# Altium schematic sheet LED_Sch1.SchDoc
size 635 x 342 mm
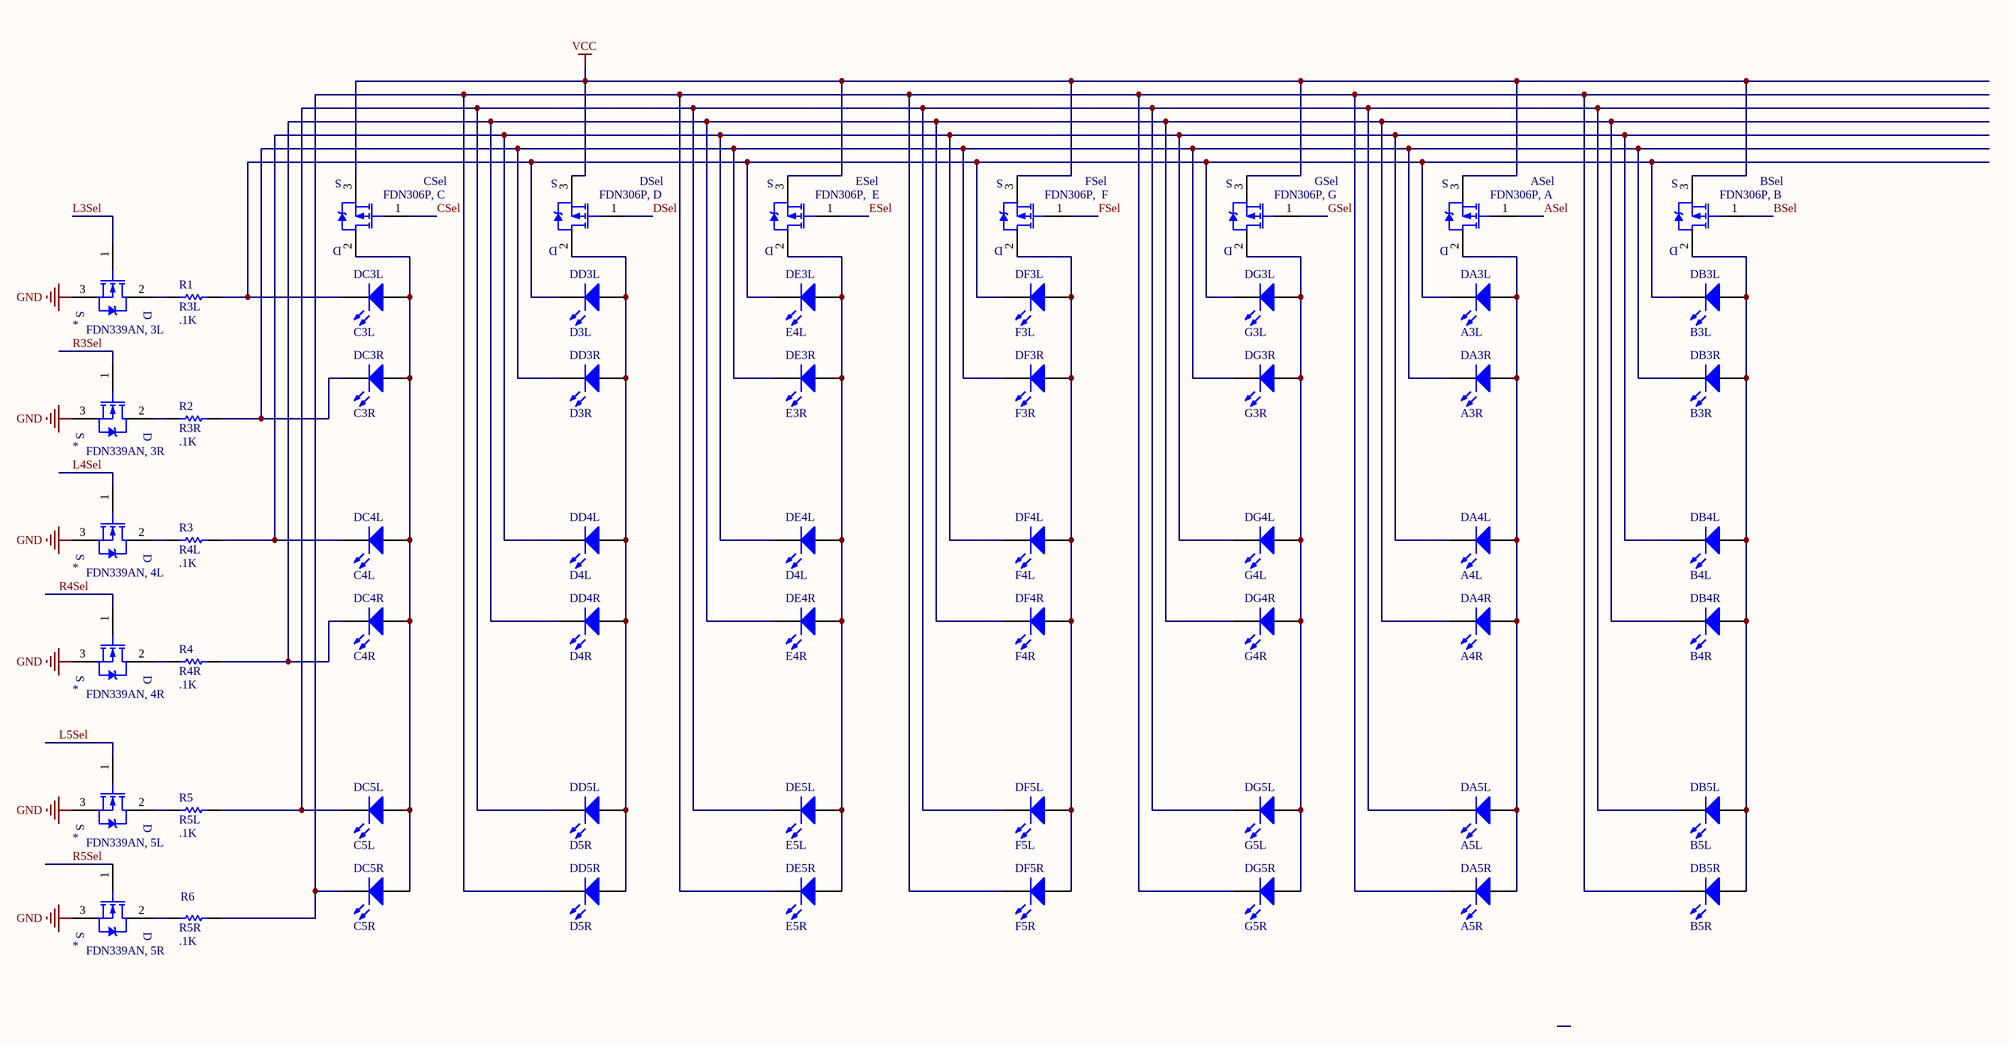
[diagram p0: LED_Sch1.SchDoc]

## Parts
(Parts that share a designator on the sheet are numbered #1, #2 ... from top to bottom, then left to right.)
*#1  FDN339AN, 3L  [SOT23-3M]
*#2  FDN339AN, 3R  [SOT23-3M]
*#3  FDN339AN, 4L  [SOT23-3M]
*#4  FDN339AN, 4R  [SOT23-3M]
*#5  FDN339AN, 5L  [SOT23-3M]
*#6  FDN339AN, 5R  [SOT23-3M]
ASel  FDN306P, A  [SOT23-3M]
BSel  FDN306P, B  [SOT23-3M]
CSel  FDN306P, C  [SOT23-3M]
DA3L  A3L  [LED-0]
DA3R  A3R  [LED-0]
DA4L  A4L  [LED-0]
DA4R  A4R  [LED-0]
DA5L  A5L  [LED-0]
DA5R  A5R  [LED-0]
DB3L  B3L  [LED-0]
DB3R  B3R  [LED-0]
DB4L  B4L  [LED-0]
DB4R  B4R  [LED-0]
DB5L  B5L  [LED-0]
DB5R  B5R  [LED-0]
DC3L  C3L  [LED-0]
DC3R  C3R  [LED-0]
DC4L  C4L  [LED-0]
DC4R  C4R  [LED-0]
DC5L  C5L  [LED-0]
DC5R  C5R  [LED-0]
DD3L  D3L  [LED-0]
DD3R  D3R  [LED-0]
DD4L  D4L  [LED-0]
DD4R  D4R  [LED-0]
DD5L  D5R  [LED-0]
DD5R  D5R  [LED-0]
DE3L  E4L  [LED-0]
DE3R  E3R  [LED-0]
DE4L  D4L  [LED-0]
DE4R  E4R  [LED-0]
DE5L  E5L  [LED-0]
DE5R  E5R  [LED-0]
DF3L  F3L  [LED-0]
DF3R  F3R  [LED-0]
DF4L  F4L  [LED-0]
DF4R  F4R  [LED-0]
DF5L  F5L  [LED-0]
DF5R  F5R  [LED-0]
DG3L  G3L  [LED-0]
DG3R  G3R  [LED-0]
DG4L  G4L  [LED-0]
DG4R  G4R  [LED-0]
DG5L  G5L  [LED-0]
DG5R  G5R  [LED-0]
DSel  FDN306P, D  [SOT23-3M]
ESel  FDN306P,  E  [SOT23-3M]
FSel  FDN306P,  F  [SOT23-3M]
GSel  FDN306P, G  [SOT23-3M]
R1  R3L  value .1K  [AXIAL-0.3]
R2  R3R  value .1K  [AXIAL-0.3]
R3  R4L  value .1K  [AXIAL-0.3]
R4  R4R  value .1K  [AXIAL-0.3]
R5  R5L  value .1K  [AXIAL-0.3]
R6  R5R  value .1K  [AXIAL-0.3]

## Nets
GND: *#1.3(S) *#2.3(S) *#3.3(S) *#4.3(S) *#5.3(S) *#6.3(S)
VCC: ASel.3(S) BSel.3(S) CSel.3(S) DSel.3(S) ESel.3(S) FSel.3(S) GSel.3(S)
ASel: ASel.1(G)
BSel: BSel.1(G)
CSel: CSel.1(G)
DSel: DSel.1(G)
ESel: ESel.1(G)
FSel: FSel.1(G)
GSel: GSel.1(G)
L3Sel: *#1.1(G)
L4Sel: *#3.1(G)
L5Sel: *#5.1(G)
R3Sel: *#2.1(G)
R4Sel: *#4.1(G)
R5Sel: *#6.1(G)
Net*#1_2: *#1.2(D) R1.1
Net*#2_2: *#2.2(D) R2.1
Net*#3_2: *#3.2(D) R3.1
Net*#4_2: *#4.2(D) R4.1
Net*#5_2: *#5.2(D) R5.1
Net*#6_2: *#6.2(D) R6.1
NetASel_2: ASel.2(D) DA3L.1(A) DA3R.1(A) DA4L.1(A) DA4R.1(A) DA5L.1(A) DA5R.1(A)
NetBSel_2: BSel.2(D) DB3L.1(A) DB3R.1(A) DB4L.1(A) DB4R.1(A) DB5L.1(A) DB5R.1(A)
NetCSel_2: CSel.2(D) DC3L.1(A) DC3R.1(A) DC4L.1(A) DC4R.1(A) DC5L.1(A) DC5R.1(A)
NetDA3L_2: DA3L.2(K) DB3L.2(K) DC3L.2(K) DD3L.2(K) DE3L.2(K) DF3L.2(K) DG3L.2(K) R1.2
NetDA3R_2: DA3R.2(K) DB3R.2(K) DC3R.2(K) DD3R.2(K) DE3R.2(K) DF3R.2(K) DG3R.2(K) R2.2
NetDA4L_2: DA4L.2(K) DB4L.2(K) DC4L.2(K) DD4L.2(K) DE4L.2(K) DF4L.2(K) DG4L.2(K) R3.2
NetDA4R_2: DA4R.2(K) DB4R.2(K) DC4R.2(K) DD4R.2(K) DE4R.2(K) DF4R.2(K) DG4R.2(K) R4.2
NetDA5L_2: DA5L.2(K) DB5L.2(K) DC5L.2(K) DD5L.2(K) DE5L.2(K) DF5L.2(K) DG5L.2(K) R5.2
NetDA5R_2: DA5R.2(K) DB5R.2(K) DC5R.2(K) DD5R.2(K) DE5R.2(K) DF5R.2(K) DG5R.2(K) R6.2
NetDD3L_1: DD3L.1(A) DD3R.1(A) DD4L.1(A) DD4R.1(A) DD5L.1(A) DD5R.1(A) DSel.2(D)
NetDE3L_1: DE3L.1(A) DE3R.1(A) DE4L.1(A) DE4R.1(A) DE5L.1(A) DE5R.1(A) ESel.2(D)
NetDF3L_1: DF3L.1(A) DF3R.1(A) DF4L.1(A) DF4R.1(A) DF5L.1(A) DF5R.1(A) FSel.2(D)
NetDG3L_1: DG3L.1(A) DG3R.1(A) DG4L.1(A) DG4R.1(A) DG5L.1(A) DG5R.1(A) GSel.2(D)

## Library data of the parts
*#1-*#6 = FDN339AN: Nch MOSFET; pin to pad: 2>3 3>2
ASel BSel CSel DSel ESel FSel GSel = FDN304P: Pch MOSFET; pin to pad: 2>3 3>2
DA3L DA3R DA4L DA4R DA5L DA5R DB3L DB3R DB4L DB4R DB5L DB5R DC3L DC3R DC4L DC4R DC5L DC5R DD3L DD3R DD4L DD4R DD5L DD5R DE3L DE3R DE4L DE4R DE5L DE5R DF3L DF3R DF4L DF4R DF5L DF5R DG3L DG3R DG4L DG4R DG5L DG5R = LED0: Typical INFRARED GaAs LED; Published: 8-Jun-2000; LatestRevisionDate: 08-Jul-2005; LatestRevisionNote: Mech Layer 1 removed.; PackageReference: LED-0; Publisher: Altium Limited; PackageDescription: LED; 2 Leads
R1-R6 = Res1: Resistor; Published: 8-Jun-2000; LatestRevisionDate: 17-Jul-2002; LatestRevisionNote: Re-released for DXP Platform.; PackageReference: AXIAL-0.3; Publisher: Altium Limited